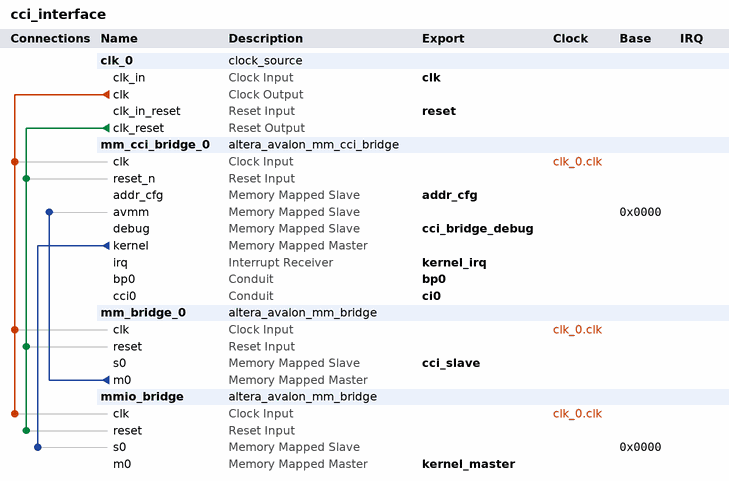
[diagram p0: system contents]
# Platform Designer (Qsys) system cci_interface, Arria 10 10AX115U3F45E2SGE3
# Parameters at their usual value, and those the tool derives, are not listed.
package require -exact qsys 16.0
create_system cci_interface
set_project_property DEVICE_FAMILY {Arria 10}
set_project_property DEVICE 10AX115U3F45E2SGE3

add_instance clk_0 clock_source 16.0
set_instance_parameter_value clk_0 clockFrequency 50000000

add_instance mm_cci_bridge_0 altera_avalon_mm_cci_bridge 13.1

add_instance mm_bridge_0 altera_avalon_mm_bridge 16.0
set_instance_parameter_value mm_bridge_0 ADDRESS_UNITS SYMBOLS
set_instance_parameter_value mm_bridge_0 ADDRESS_WIDTH 64
set_instance_parameter_value mm_bridge_0 DATA_WIDTH 512
set_instance_parameter_value mm_bridge_0 MAX_BURST_SIZE 4
set_instance_parameter_value mm_bridge_0 MAX_PENDING_RESPONSES 64
set_instance_parameter_value mm_bridge_0 USE_AUTO_ADDRESS_WIDTH 0

add_instance mmio_bridge altera_avalon_mm_bridge 16.0
set_instance_parameter_value mmio_bridge ADDRESS_UNITS SYMBOLS
set_instance_parameter_value mmio_bridge ADDRESS_WIDTH 10
set_instance_parameter_value mmio_bridge DATA_WIDTH 64
set_instance_parameter_value mmio_bridge MAX_PENDING_RESPONSES 1024
set_instance_parameter_value mmio_bridge USE_AUTO_ADDRESS_WIDTH 1

# connections
add_connection clk_0.clk mm_bridge_0.clk clock
add_connection clk_0.clk mm_cci_bridge_0.clk clock
add_connection clk_0.clk mmio_bridge.clk clock
add_connection clk_0.clk_reset mm_bridge_0.reset reset
add_connection clk_0.clk_reset mm_cci_bridge_0.reset_n reset
add_connection clk_0.clk_reset mmio_bridge.reset reset
add_connection mm_bridge_0.m0 mm_cci_bridge_0.avmm avalon
set_connection_parameter_value mm_bridge_0.m0/mm_cci_bridge_0.avmm baseAddress 0x0000
add_connection mm_cci_bridge_0.kernel mmio_bridge.s0 avalon
set_connection_parameter_value mm_cci_bridge_0.kernel/mmio_bridge.s0 baseAddress 0x0000

# exported interfaces
add_interface addr_cfg avalon slave
set_interface_property addr_cfg EXPORT_OF mm_cci_bridge_0.addr_cfg
add_interface bp0 conduit end
set_interface_property bp0 EXPORT_OF mm_cci_bridge_0.bp0
add_interface cci_bridge_debug avalon slave
set_interface_property cci_bridge_debug EXPORT_OF mm_cci_bridge_0.debug
add_interface cci_slave avalon slave
set_interface_property cci_slave EXPORT_OF mm_bridge_0.s0
add_interface ci0 conduit end
set_interface_property ci0 EXPORT_OF mm_cci_bridge_0.cci0
add_interface clk clock sink
set_interface_property clk EXPORT_OF clk_0.clk_in
add_interface kernel_irq interrupt receiver
set_interface_property kernel_irq EXPORT_OF mm_cci_bridge_0.irq
add_interface kernel_master avalon master
set_interface_property kernel_master EXPORT_OF mmio_bridge.m0
add_interface reset reset sink
set_interface_property reset EXPORT_OF clk_0.clk_in_reset

set_interconnect_requirement {$system} qsys_mm.clockCrossingAdapter HANDSHAKE
set_interconnect_requirement {$system} qsys_mm.insertDefaultSlave false
set_interconnect_requirement {$system} qsys_mm.maxAdditionalLatency 1

save_system cci_interface.qsys
